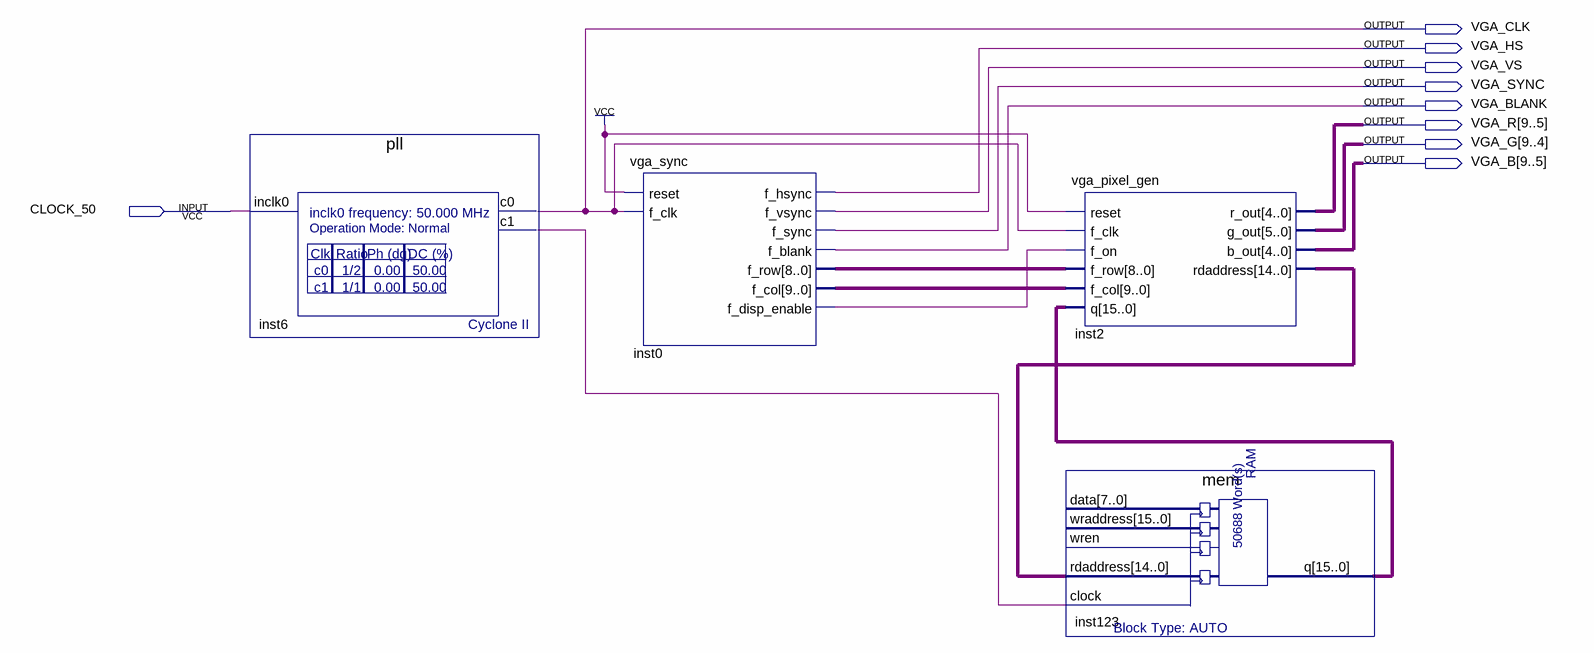
[diagram p0: schematic sheet]
// Quartus schematic schem.bdf as structural Verilog: 4 symbols, 9 pins
module schem (
  input  CLOCK_50,
  output VGA_CLK,
  output VGA_HS,
  output VGA_VS,
  output VGA_SYNC,
  output VGA_BLANK,
  output [9:5] VGA_R,
  output [9:4] VGA_G,
  output [9:5] VGA_B
);

  wire inst0_f_disp_enable, inst6_c1;
  wire [8:0] inst0_f_row;
  wire [9:0] inst0_f_col;
  wire [14:0] inst2_rdaddress;
  wire [15:0] inst123_q;

  pll inst6 (.inclk0(CLOCK_50), .c0(VGA_CLK), .c1(inst6_c1));
  vga_sync inst0 (
    .reset(1'b1), .f_clk(VGA_CLK), .f_hsync(VGA_HS), .f_vsync(VGA_VS), .f_sync(VGA_SYNC),
    .f_blank(VGA_BLANK), .f_row(inst0_f_row), .f_col(inst0_f_col), .f_disp_enable(inst0_f_disp_enable));
  vga_pixel_gen inst2 (
    .reset(1'b1), .f_clk(VGA_CLK), .f_on(inst0_f_disp_enable), .f_row(inst0_f_row), .f_col(inst0_f_col),
    .q(inst123_q), .r_out(VGA_R), .g_out(VGA_G), .b_out(VGA_B), .rdaddress(inst2_rdaddress));
  mem inst123 (.rdaddress(inst2_rdaddress), .clock(inst6_c1), .q(inst123_q));  // open: data, wraddress, wren
endmodule
